# Altium schematic sheet JLink-OB-072-Wiki-A1.SchDoc
size A4
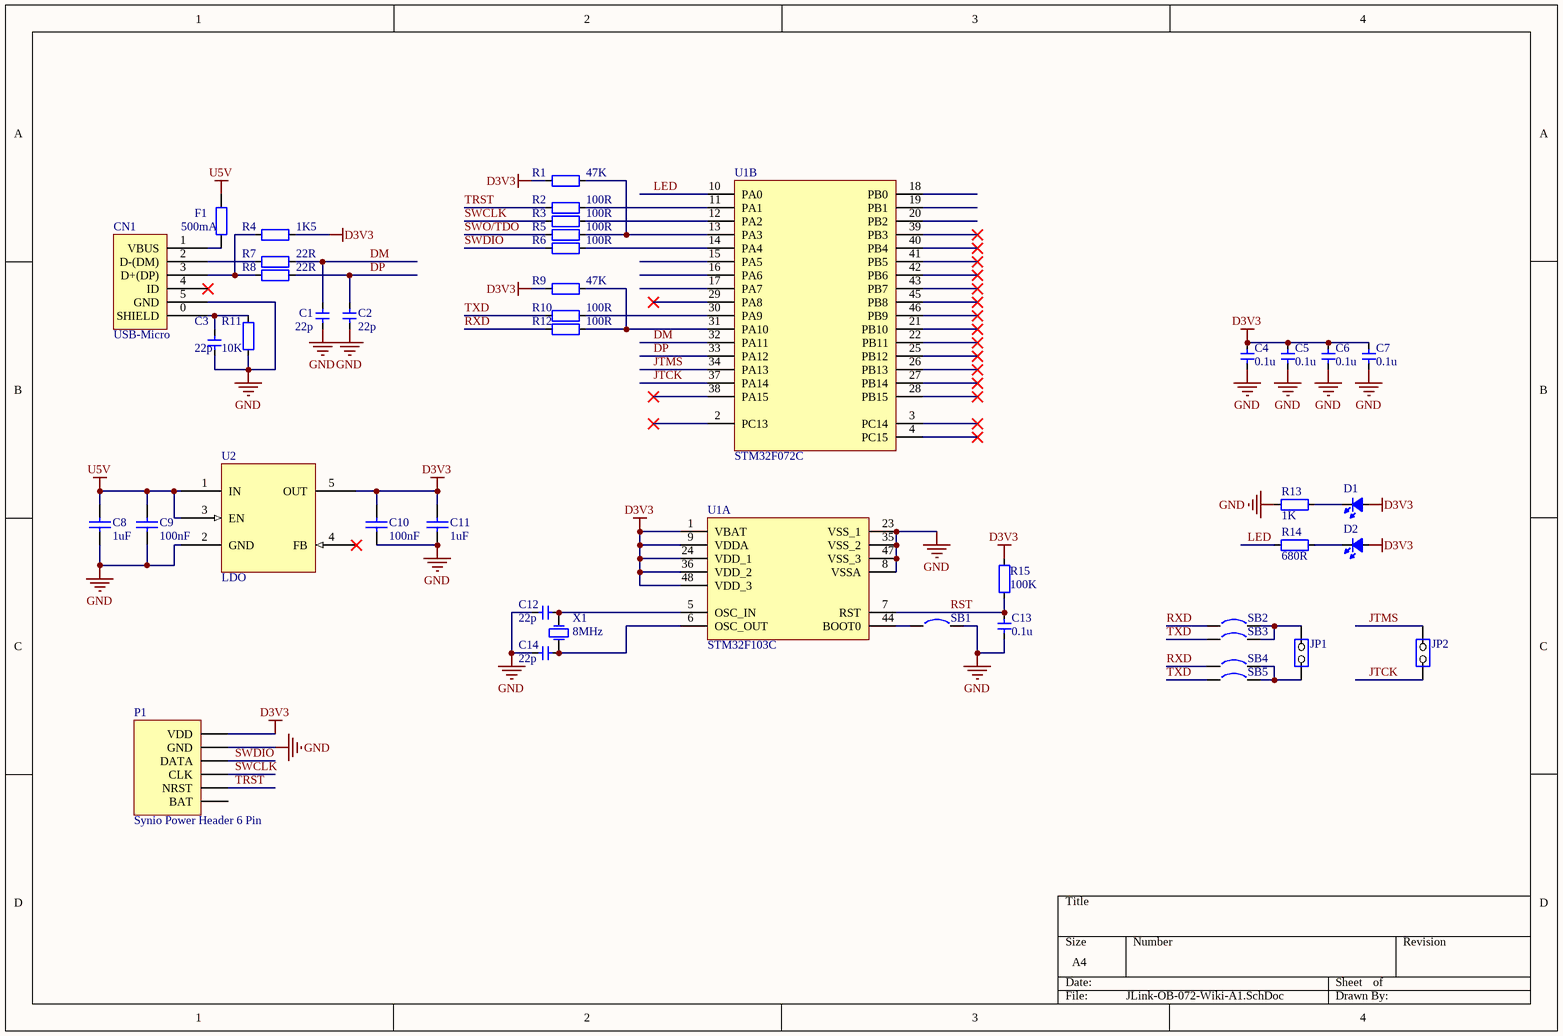
[diagram p0: JLink-OB-072-Wiki-A1.SchDoc]

## Parts
C1  value 22p  [0603C]  (hidden comment: Cap_0603)
C2  value 22p  [0603C]  (hidden comment: Cap_0603)
C3  value 22p  [0603C]  (hidden comment: Cap_0603)
C4  value 0.1u  [0603C]  (hidden comment: Cap_0603)
C5  value 0.1u  [0603C]  (hidden comment: Cap_0603)
C6  value 0.1u  [0603C]  (hidden comment: Cap_0603)
C7  value 0.1u  [0603C]  (hidden comment: Cap_0603)
C8  1uF  [0603C]
C9  100nF  [0603C]
C10  100nF  [0603C]
C11  1uF  [0603C]
C12  value 22p  [0603C]  (hidden comment: Cap_0603)
C13  value 0.1u  [0603C]  (hidden comment: Cap_0603)
C14  value 22p  [0603C]  (hidden comment: Cap_0603)
CN1  USB-Micro  [USB_MICRO_5S_B]
D1  LED_0603  [LED-0603]  (value not drawn)
D2  LED_0603  [LED-0603]  (value not drawn)
F1  500mA  [0805M]
JP1  JP2  [HDR1X2/2.54mm]  (value not drawn)
JP2  JP2  [HDR1X2/2.54mm]  (value not drawn)
P1  Synio Power Header 6 Pin  [HDR1X6/2.54MM]
R1  value 47K  [0603R]  (hidden comment: Res_0603)
R2  value 100R  [0603R]  (hidden comment: Res_0603)
R3  value 100R  [0603R]  (hidden comment: Res_0603)
R4  value 1K5  [0603R]  (hidden comment: Res_0603)
R5  value 100R  [0603R]  (hidden comment: Res_0603)
R6  value 100R  [0603R]  (hidden comment: Res_0603)
R7  value 22R  [0603R]  (hidden comment: Res_0603)
R8  value 22R  [0603R]  (hidden comment: Res_0603)
R9  value 47K  [0603R]  (hidden comment: Res_0603)
R10  value 100R  [0603R]  (hidden comment: Res_0603)
R11  value 10K  [0603R]  (hidden comment: Res_0603)
R12  value 100R  [0603R]  (hidden comment: Res_0603)
R13  value 1K  [0603R]  (hidden comment: Res_0603)
R14  value 680R  [0603R]  (hidden comment: Res_0603)
R15  value 100K  [0603R]  (hidden comment: Res_0603)
SB1  Circuit Breaker  [JP2_SMD]  (value not drawn)
SB2  Circuit Breaker  [JP2_SMD]  (value not drawn)
SB3  Circuit Breaker  [JP2_SMD]  (value not drawn)
SB4  Circuit Breaker  [JP2_SMD]  (value not drawn)
SB5  Circuit Breaker  [JP2_SMD]  (value not drawn)
U1  STM32F103C  [LQFP48_N]  (parts A,B of 2)
U2  LDO  [SOT23-5]
X1  value 8MHz  [XTAL]  (hidden comment: XTAL_5032_2P)

## Nets
D3V3: C4.1 C5.1 C6.1 C7.1 C10.2 C11.2 D1.1(A) D2.1(A) P1.1(VDD) R1.2 R4.2 R9.2 R15.2 U1.1(VBAT) U1.9(VDDA) U1.24(VDD_1) U1.36(VDD_2) U1.48(VDD_3) U2.5(OUT)
GND: C1.1 C2.1 C3.1 C4.2 C5.2 C6.2 C7.2 C8.1 C9.1 C10.1 C11.1 C12.2 C13.2 C14.2 CN1.5(GND) P1.2(GND) R11.1 R13.1 SB1.2 U1.8(VSSA) U1.23(VSS_1) U1.35(VSS_2) U1.47(VSS_3) U2.2(GND)
U5V: C8.2 C9.2 F1.2 U2.1(IN) U2.3(EN)
DM: C1.2 R7.2 U1.32(PA11)
DP: C2.2 R8.2 U1.33(PA12)
JTCK: JP2.1(COMMON) U1.37(PA14)
JTMS: JP2.2(NO) U1.34(PA13)
LED: R14.1 U1.10(PA0)
RST: C13.1 R15.1 U1.7(RST)
RXD: R12.1 SB2.1 SB4.1
SWCLK: P1.4(CLK) R3.1
SWDIO: P1.3(DATA) R6.1
SWO/TDO: R5.1
TRST: P1.5(NRST) R2.1
TXD: R10.1 SB3.1 SB5.1
NetC3_2: C3.2 CN1.0(SHIELD) R11.2
NetC12_1: C12.1 U1.5(OSC_IN) X1.2(OSC2)
NetC14_1: C14.1 U1.6(OSC_OUT) X1.1(OSC1)
NetCN1_1: CN1.1(VBUS) F1.1
NetCN1_2: CN1.2(D-(DM)) R7.1
NetCN1_3: CN1.3(D+(DP)) R4.1 R8.1
NetD1_2: D1.2(K) R13.2
NetD2_2: D2.2(K) R14.2
NetJP1_1: JP1.1(COMMON) SB4.2 SB5.2
NetJP1_2: JP1.2(NO) SB2.2 SB3.2
NetR1_1: R1.1 R5.2 U1.13(PA3)
NetR2_2: R2.2 U1.11(PA1)
NetR3_2: R3.2 U1.12(PA2)
NetR6_2: R6.2 U1.14(PA4)
NetR9_1: R9.1 R12.2 U1.31(PA10)
NetR10_2: R10.2 U1.30(PA9)
NetSB1_1: SB1.1 U1.44(BOOT0)

Not connected (* = marked no-connect by the designer): CN1 4(ID)*; P1 6(BAT); U1 2(PC13)* 3(PC14)* 4(PC15)* 15(PA5) 16(PA6) 17(PA7) 18(PB0) 19(PB1) 20(PB2) 21(PB10)* 22(PB11)* 25(PB12)* 26(PB13)* 27(PB14)* 28(PB15)* 29(PA8)* 38(PA15)* 39(PB3)* 40(PB4)* 41(PB5)* 42(PB6)* 43(PB7)* 45(PB8)* 46(PB9)*; U2 4(FB)*

## Library data of the parts
C1-C7 C12-C14 = Cap_0603: Capacitor
C8 C11 = Capacitor_ST: Capacitor 0402 / 0603 / 0805; Value: 100nF; Revision: July-2002: Re-released for DXP Platform.
C9 C10 = Capacitor_ST: Capacitor 0402 / 0603 / 0805; Revision: July-2002: Re-released for DXP Platform.; Value: 100nF
D1 D2 = LED_0603: LED
F1 = Res: Resistor; Published: 8-Jun-2000; LatestRevisionDate: 17-Jul-2002; LatestRevisionNote: Re-released for DXP Platform.; PackageReference: AXIAL-0.4; Publisher: Altium Limited; Value: 500mA
R1-R15 = Res_0603: Resistor
SB1-SB5 = Circuit Breaker: Solder: YES; Published: 24-Mar-1999; Revision: July-2002: Re-released for DXP Platform.; Publisher: Altium Limited
U1 = STM32F103C: MCU
U2 = LDO-SOT23-5: General LDO SOT23-5
X1 = XTAL_5032_2P: Crystal Oscillator